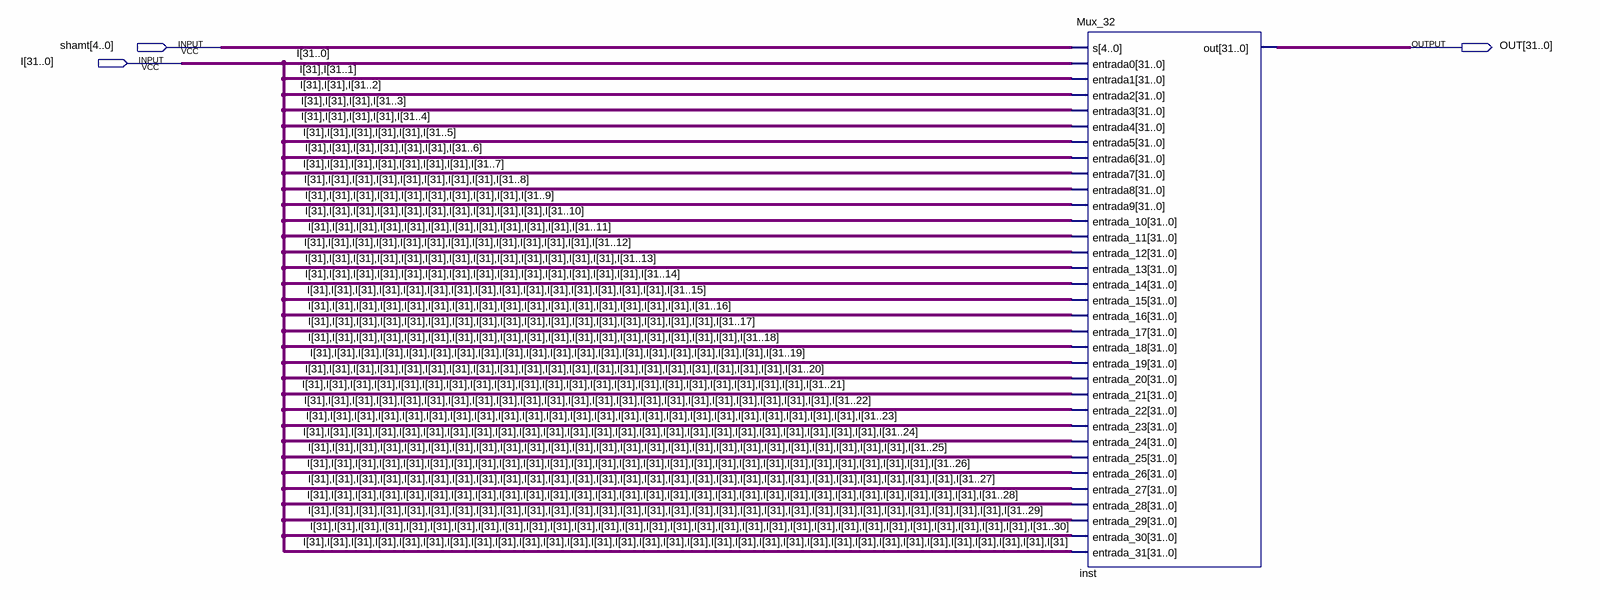
[diagram p0: schematic sheet]
// Quartus schematic Shift_right_arithmetic.bdf as structural Verilog: 1 symbols, 3 pins
module Shift_right_arithmetic (
  input  [4:0] shamt,
  input  [31:0] I,
  output [31:0] OUT
);

  Mux_32 inst (
    .s(shamt), .entrada0(I), .entrada1({{2{I[31]}}, I[30:1]}), .entrada2({{3{I[31]}}, I[30:2]}),
    .entrada3({{4{I[31]}}, I[30:3]}), .entrada4({{5{I[31]}}, I[30:4]}), .entrada5({{6{I[31]}}, I[30:5]}),
    .entrada6({{7{I[31]}}, I[30:6]}), .entrada7({{8{I[31]}}, I[30:7]}), .entrada8({{9{I[31]}}, I[30:8]}),
    .entrada9({{10{I[31]}}, I[30:9]}), .entrada_10({{11{I[31]}}, I[30:10]}),
    .entrada_11({{12{I[31]}}, I[30:11]}), .entrada_12({{13{I[31]}}, I[30:12]}),
    .entrada_13({{14{I[31]}}, I[30:13]}), .entrada_14({{15{I[31]}}, I[30:14]}),
    .entrada_15({{16{I[31]}}, I[30:15]}), .entrada_16({{17{I[31]}}, I[30:16]}),
    .entrada_17({{18{I[31]}}, I[30:17]}), .entrada_18({{19{I[31]}}, I[30:18]}),
    .entrada_19({{20{I[31]}}, I[30:19]}), .entrada_20({{21{I[31]}}, I[30:20]}),
    .entrada_21({{22{I[31]}}, I[30:21]}), .entrada_22({{23{I[31]}}, I[30:22]}),
    .entrada_23({{24{I[31]}}, I[30:23]}), .entrada_24({{25{I[31]}}, I[30:24]}),
    .entrada_25({{26{I[31]}}, I[30:25]}), .entrada_26({{27{I[31]}}, I[30:26]}),
    .entrada_27({{28{I[31]}}, I[30:27]}), .entrada_28({{29{I[31]}}, I[30:28]}),
    .entrada_29({{30{I[31]}}, I[30:29]}), .entrada_30({{31{I[31]}}, I[30]}), .entrada_31({32{I[31]}}),
    .out(OUT));
endmodule
